# Altium schematic sheet MTCH9010_Evaluation_Kit.SchDoc
size A3; SheetTitle: MTCH9010 Evaluation Kit; CompanyName: Microchip Technology Inc.; Organization: Microchip Technology; Address1: 2355 West Chandler Blvd.; Address2: Chandler, AZ  85224; Address4: USA; SheetNumber: 2; SheetTotal: 4; Time: Time
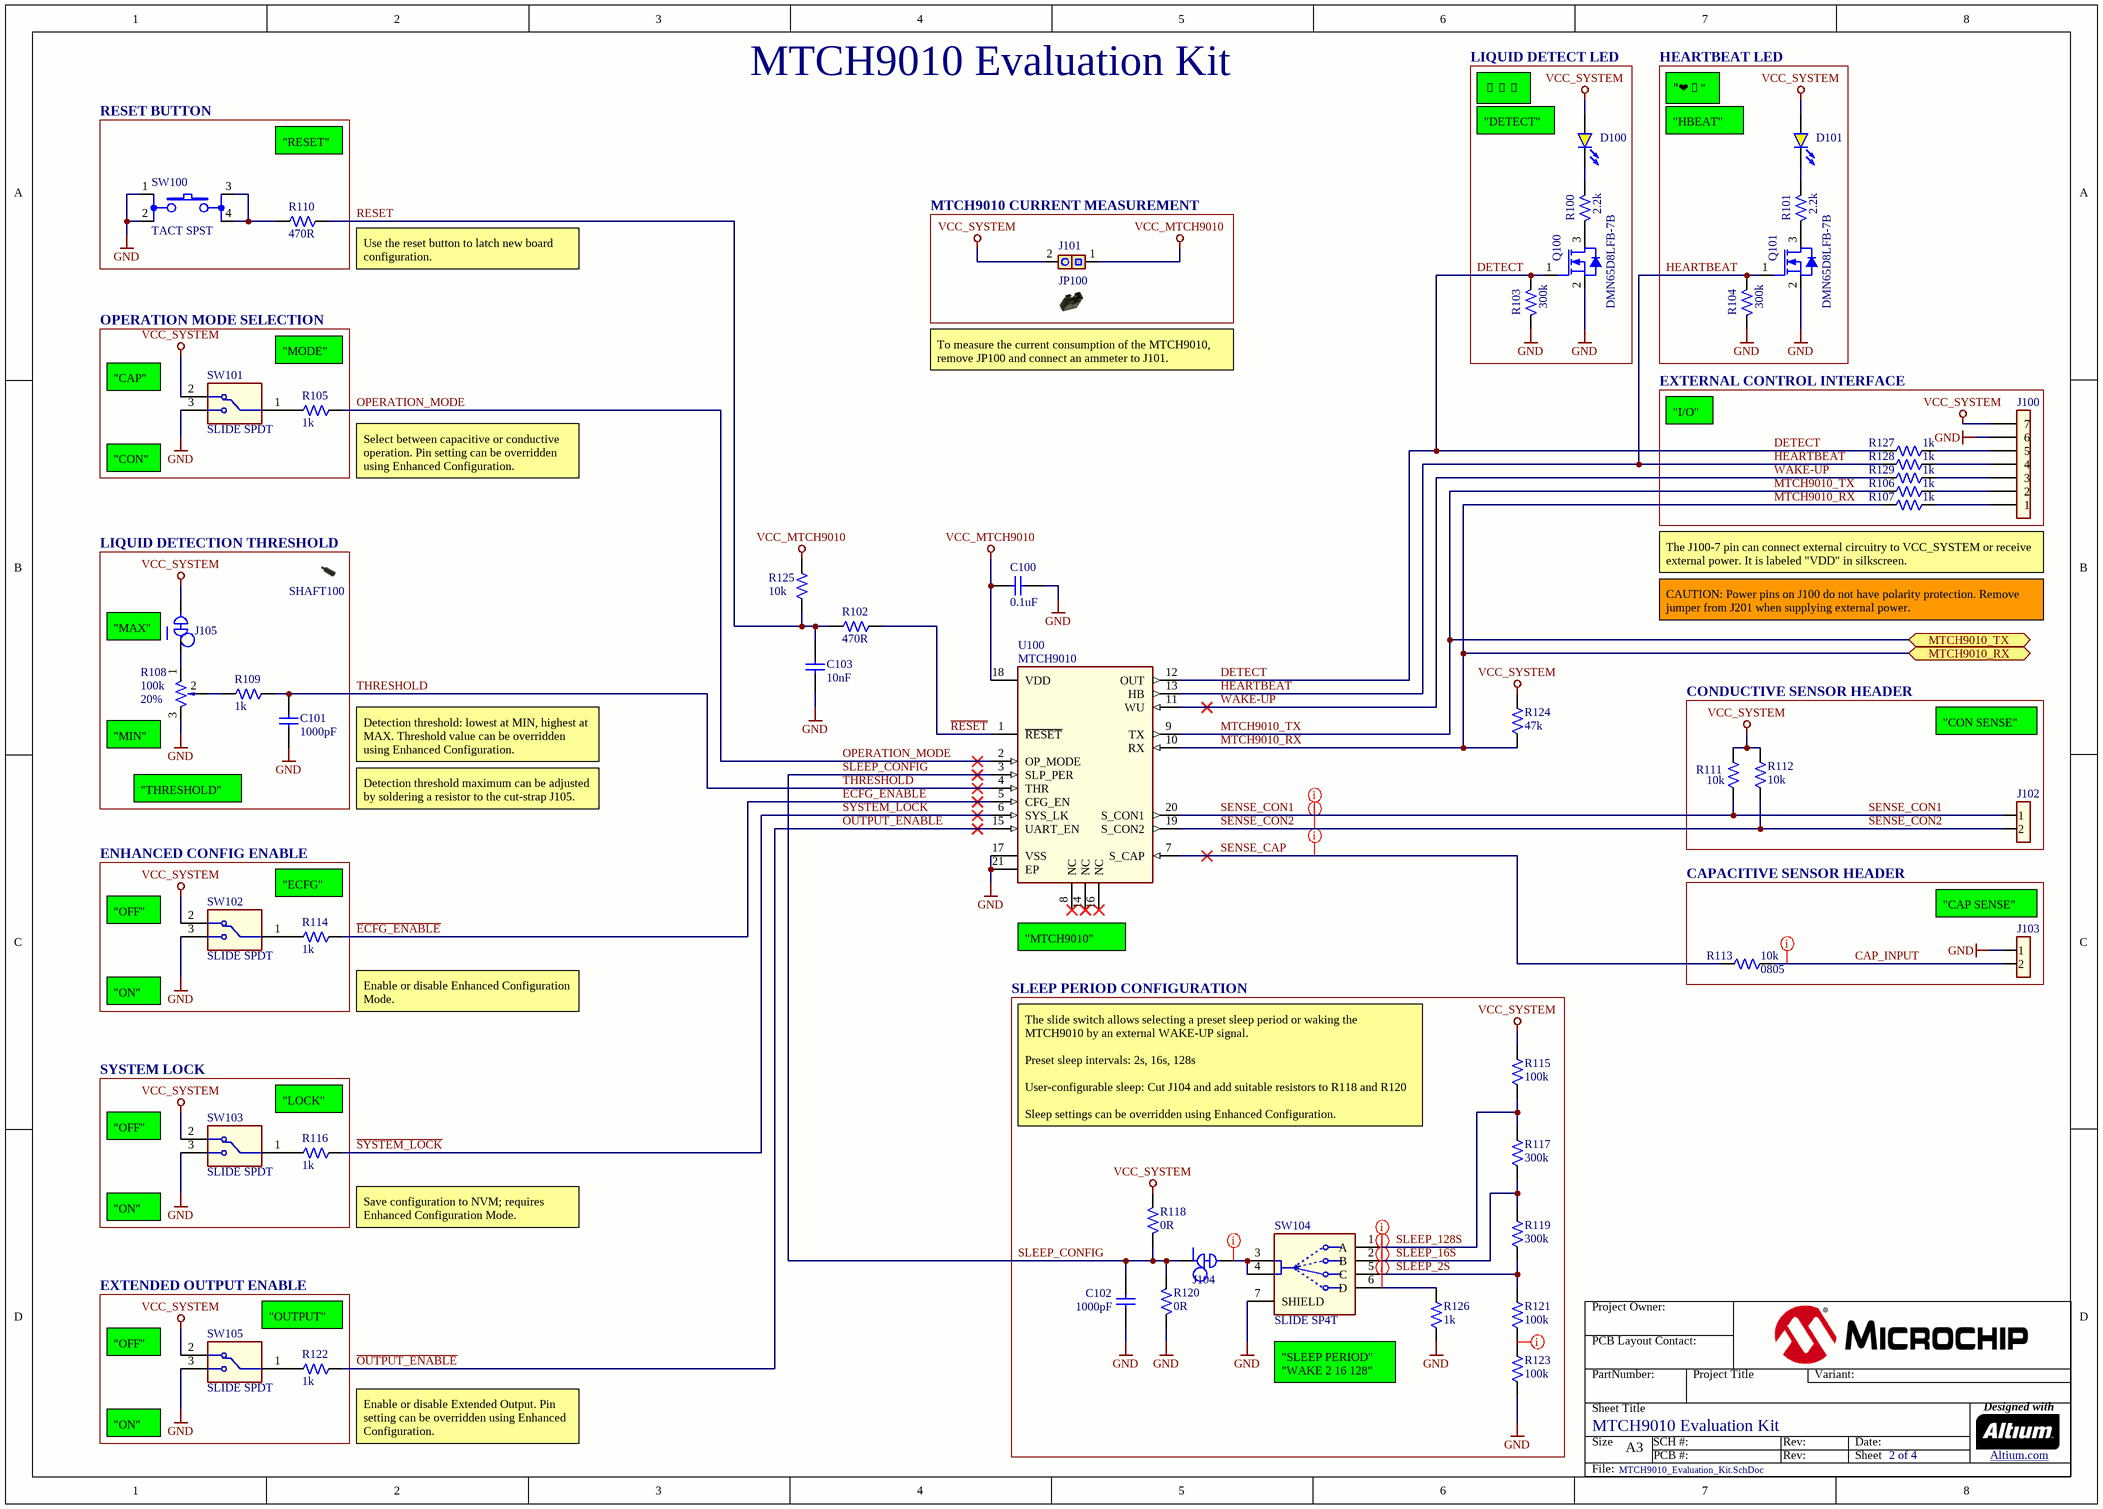
[diagram p0: MTCH9010_Evaluation_Kit.SchDoc]

## Parts
C100  value 0.1uF  [CAP_C_0402]  (hidden comment: Capacitor NP)
C101  value 1000pF  [CAP_C_0402]  (hidden comment: Capacitor NP)
C102  value 1000pF  [CAP_C_0402]  (hidden comment: Capacitor NP)
C103  value 10nF  [CAP_C_0402]  (hidden comment: Capacitor NP)
D100  LED_yellow  [LED_DIA_597-6xxx_1206_RM]  (value not drawn)
D101  LED_yellow  [LED_DIA_597-6xxx_1206_RM]  (value not drawn)
J100  Header 1x7  [HDR_F_2.54_1x7_TH-PIP_RA_WCON_2185-107RSNCYNR1]  (value not drawn)
J101  Header 1x2  [HDR_M_2.54_1X2_U_TH-PIP_RA_WCON_1125-1102S0R140CR01]  (value not drawn)
J102  Header 1x2  [HDR_F_2.54_1x2_TH-PIP_RA_WCON_2185-102RSNCYNR1]  (value not drawn)
J103  Header 1x2  [HDR_F_2.54_1x2_TH-PIP_RA_WCON_2185-102RSNCYNR1]  (value not drawn)
J104  CON JMPR LINK CLOSED  [CON_JMPR_0402_PCB_TRACE_LINK]  (value not drawn)  (net tie, no BOM)
J105  CON JMPR LINK CLOSED  [CON_JMPR_0603_PCB_TRACE_LINK_N]  (value not drawn)  (net tie, no BOM)
JP100  Jumper Mechanical  [Jumper_Mechanical]  (value not drawn)
Q100  value DMN65D8LFB-7B  [X1-DFN1006-3]  (hidden comment: Transistor MOS-N GSD)
Q101  value DMN65D8LFB-7B  [X1-DFN1006-3]  (hidden comment: Transistor MOS-N GSD)
R100  value 2.2k  [RES_C_0402]  (hidden comment: Resistor)
R101  value 2.2k  [RES_C_0402]  (hidden comment: Resistor)
R102  value 470R  [RES_C_0402]  (hidden comment: Resistor)
R103  value 300k  [RES_C_0402]  (hidden comment: Resistor)
R104  value 300k  [RES_C_0402]  (hidden comment: Resistor)
R105  value 1k  [RES_C_0402]  (hidden comment: Resistor)
R106  value 1k  [RES_C_0402]  (hidden comment: Resistor)
R107  value 1k  [RES_C_0402]  (hidden comment: Resistor)
R108  value 100k  Tolerance: 20%  [RES_VAR_PIHER_PS-10V60_L10.9W10.3H5.7]  (hidden comment: Resistor Var)
R109  value 1k  [RES_C_0402]  (hidden comment: Resistor)
R110  value 470R  [RES_C_0402]  (hidden comment: Resistor)
R111  value 10k  [RES_C_0805]  (hidden comment: Resistor)
R112  value 10k  [RES_C_0805]  (hidden comment: Resistor)
R113  value 10k  Package: 0805  [RES_C_0805]  (hidden comment: Resistor)
R114  value 1k  [RES_C_0402]  (hidden comment: Resistor)
R115  value 100k  [RES_C_0402]  (hidden comment: Resistor)
R116  value 1k  [RES_C_0402]  (hidden comment: Resistor)
R117  value 300k  [RES_C_0402]  (hidden comment: Resistor)
R118  value 0R  [RES_C_0603]  (hidden comment: Resistor)
R119  value 300k  [RES_C_0402]  (hidden comment: Resistor)
R120  value 0R  [RES_C_0603]  (hidden comment: Resistor)
R121  value 100k  [RES_C_0402]  (hidden comment: Resistor)
R122  value 1k  [RES_C_0402]  (hidden comment: Resistor)
R123  value 100k  [RES_C_0402]  (hidden comment: Resistor)
R124  value 47k  [RES_C_0402]  (hidden comment: Resistor)
R125  value 10k  [RES_C_0402]  (hidden comment: Resistor)
R126  value 1k  [RES_C_0402]  (hidden comment: Resistor)
R127  value 1k  [RES_C_0402]  (hidden comment: Resistor)
R128  value 1k  [RES_C_0402]  (hidden comment: Resistor)
R129  value 1k  [RES_C_0402]  (hidden comment: Resistor)
SHAFT100  PT10_SHAFT  [PT10_Shaft_Mechanical]  (value not drawn)
SW100  value TACT SPST  [SW_TACT_SMD_DW_TS604VM1-035CR-R]  (hidden comment: Switch 4 Pin)
SW101  value SLIDE SPDT  [SW_SLIDE_SMD_SS_SLW-88229-2-SMT-TR]  (hidden comment: SWITCH SLIDE SMD SPDT SLW-88229-2-SMT-TR)
SW102  value SLIDE SPDT  [SW_SLIDE_SMD_SS_SLW-88229-2-SMT-TR]  (hidden comment: SWITCH SLIDE SMD SPDT SLW-88229-2-SMT-TR)
SW103  value SLIDE SPDT  [SW_SLIDE_SMD_SS_SLW-88229-2-SMT-TR]  (hidden comment: SWITCH SLIDE SMD SPDT SLW-88229-2-SMT-TR)
SW104  value SLIDE SP4T  [SW_SLIDE_SMD_RA_SP4T_L-KLS7-MSS-1400SD-BR]  (hidden comment: SWITCH SLIDE SMD SP4T)
SW105  value SLIDE SPDT  [SW_SLIDE_SMD_SS_SLW-88229-2-SMT-TR]  (hidden comment: SWITCH SLIDE SMD SPDT SLW-88229-2-SMT-TR)
U100  value MTCH9010  [VQFN-20_3X3_EP1.8x1.8_NO_VIAS]  (hidden comment: MTCH9010-VQFN20)

## Blocks framed on the sheet
LIQUID DETECT LED: D100 Q100 R100 R103
HEARTBEAT LED: D101 Q101 R101 R104
RESET BUTTON: R110 SW100
MTCH9010 CURRENT MEASUREMENT: J101 JP100
OPERATION MODE SELECTION: R105 SW101
EXTERNAL CONTROL INTERFACE: J100 R106 R107 R127-R129
LIQUID DETECTION THRESHOLD: C101 J105 R108 R109 SHAFT100
CONDUCTIVE SENSOR HEADER: J102 R111 R112
ENHANCED CONFIG ENABLE: R114 SW102
CAPACITIVE SENSOR HEADER: J103 R113
SLEEP PERIOD CONFIGURATION: C102 J104 R115 R117-R121 R123 R126 SW104
SYSTEM LOCK: R116 SW103
EXTENDED OUTPUT ENABLE: R122 SW105

## Ports
MTCH9010_RX (bidir), MTCH9010_TX (bidir)

## Nets
GND: C100.2 C101.1 C102.1 C103.2 J100.6 J103.1 Q100.2(S) Q101.2(S) R103.1 R104.1 R108.3(CW) R120.1 R123.1 R126.2 SW100.1 SW100.2 SW101.3 SW102.3 SW103.3 SW104.7(SHIELD) SW105.3 U100.17(VSS) U100.21(EP)
VCC_MTCH9010: C100.1 J101.1 R125.2 U100.18(VDD)
VCC_SYSTEM: D100.1(A) D101.1(A) J100.7 J101.2 J105.2 R111.2 R112.2 R115.2 R118.2 R124.2 SW101.2 SW102.2 SW103.2 SW105.2
~{ECFG_ENABLE}: R114.1 U100.5(CFG_EN)
~{OUTPUT_ENABLE}: R122.1 U100.15(UART_EN)
~{RESET}: R102.1 U100.1(~{RESET})
~{SYSTEM_LOCK}: R116.1 U100.6(SYS_LK)
CAP_INPUT: J103.2 R113.2
DETECT: Q100.1(G) R103.2 R127.2 U100.12(OUT)
HEARTBEAT: Q101.1(G) R104.2 R128.2 U100.13(HB)
MTCH9010_RX: R107.2 R124.1 U100.10(RX) ; port MTCH9010_RX
MTCH9010_TX: R106.2 U100.9(TX) ; port MTCH9010_TX
OPERATION_MODE: R105.1 U100.2(OP_MODE)
RESET: C103.1 R102.2 R110.1 R125.1
SENSE_CAP: R113.1 U100.7(S_CAP)
SENSE_CON1: J102.1 R111.1 U100.20(S_CON1)
SENSE_CON2: J102.2 R112.1 U100.19(S_CON2)
SLEEP_2S: R119.2 R121.2 SW104.5(C)
SLEEP_16S: R117.2 R119.1 SW104.2(B)
SLEEP_128S: R115.1 R117.1 SW104.1(A)
SLEEP_CONFIG: C102.2 J104.1 R118.1 R120.2 U100.3(SLP_PER)
THRESHOLD: C101.2 R109.1 U100.4(THR)
WAKE-UP: R129.2 U100.11(WU)
NetD100_2: D100.2(K) R100.2
NetD101_2: D101.2(K) R101.2
NetJ100_1: J100.1 R107.1
NetJ100_2: J100.2 R106.1
NetJ100_3: J100.3 R129.1
NetJ100_4: J100.4 R128.1
NetJ100_5: J100.5 R127.1
NetJ104_2: J104.2 SW104.3 SW104.4
NetJ105_1: J105.1 R108.1(CCW)
NetQ100_3: Q100.3(D) R100.1
NetQ101_3: Q101.3(D) R101.1
NetR105_2: R105.2 SW101.1
NetR108_2: R108.2(Wiper) R109.2
NetR110_2: R110.2 SW100.3 SW100.4
NetR114_2: R114.2 SW102.1
NetR116_2: R116.2 SW103.1
NetR121_1: R121.1 R123.2
NetR122_2: R122.2 SW105.1
NetR126_1: R126.1 SW104.6(D)

Not connected (* = marked no-connect by the designer): U100 8(NC)* 14(NC)* 16(NC)*

## Layout directives
net class SENSE; net class NO TESTPOINT: CAP_INPUT, SENSE_CAP, SENSE_CON1, SENSE_CON2
net class NO TESTPOINT: NetJ104_2, NetR121_1, NetR126_1, SLEEP_2S, SLEEP_16S, SLEEP_128S

## Notes on the sheet
- MTCH9010 Evaluation Kit
- "💧"
- "❤️"
- "RESET"
- (near D100) "DETECT"
- "HBEAT"
- (near R110) Use the reset button to latch new board configuration.
- "MODE"
- (near JP100) To measure the current consumption of the MTCH9010, remove JP100 and connect an ammeter to J101.
- (near SW101) "CAP"
- "I/O"
- "CON"
- (near R105) Select between capacitive or conductive operation. Pin setting can be overridden using Enhanced Configuration.
- The J100-7 pin can connect external circuitry to VCC_SYSTEM or receive external power. It is labeled "VDD" in silkscreen.
- (near J105) "MAX"
- CAUTION: Power pins on J100 do not have polarity protection. Remove jumper from J201 when supplying external power.
- (near R108) "MIN"
- Detection threshold: lowest at MIN, highest at MAX. Threshold value can be overridden using Enhanced Configuration.
- "CON SENSE"
- "THRESHOLD"
- Detection threshold maximum can be adjusted by soldering a resistor to the cut-strap J105.
- (near SW102) "OFF"
- "ECFG"
- (near J103) "CAP SENSE"
- (near U100) "MTCH9010"
- "ON"
- (near R114) Enable or disable Enhanced Configuration Mode.
- "LOCK"
- The slide switch allows selecting a preset sleep period or waking the MTCH9010 by an external WAKE-UP signal.
  Preset sleep intervals: 2s, 16s, 128s
  User-configurable sleep: Cut J104 and add suitable resistors to R118 and R120
  Sleep settings can be overridden using Enhanced Configuration.
- (near SW103) "OFF"
- (near R116) Save configuration to NVM; requires Enhanced Configuration Mode.
- "OUTPUT"
- (near SW105) "OFF"
- "SLEEP PERIOD"
  "WAKE 2 16 128"
- (near R122) Enable or disable Extended Output. Pin setting can be overridden using Enhanced Configuration.
- Project Owner:
- PCB Layout Contact:
- PartNumber:
- Project Title
- Variant:
- Sheet Title
- Size
- A3
- SCH #:
- PCB #:
- Rev:
- Date:
- Sheet
- Designed with
- Altium.com <http://go.altium.com/MicrochipLandingPage_Evaluation.html>
- File:

## Library data of the parts
C100 = CAP1033: Manufacturer 1: KEMET; Manufacturer Part Number 1: C0402C104K4RAC7867; Voltage: 16V; Description_: CAP CER 0.1uF 16V 10% X7R SMD 0402; Tolerance: 10%; Type: Ceramic; Populated: Yes; Temperature Coefficient: X7R; MCHP-ID: CAP1033; Package: 0402; Revision: 11; Symbol: Capacitor NP; Operating Temperature: -55C to +125C; Category: Capacitor; Manufacturer 2: Samsung Electro-Mechanics; Manufacturer Part Number 2: CL05B104KO5NNNC; Supplier 1: Digi-Key; Supplier Part Number 1: 399-C0402C104K4RAC7867TR-ND; Supplier 2: Digi-Key; Supplier Part Number 2: 1276-1001-1-ND; Manufacturer 3: Würth Elektronik; Manufacturer Part Number 3: 885012205037; Manufacturer 4: Samsung Electro-Mechanics; Manufacturer Part Number 4: CL05B104KO5NNND; Manufacturer 5: Samsung Electro-Mechanics; Manufacturer Part Number 5: CL05B104KO5NNNO; Manufacturer 6: Yageo; Manufacturer Part Number 6: CC0402KRX7R7BB104; Supplier 3: Digi-Key; Supplier Part Number 3: 732-7532-1-ND; Supplier 4: Mouser; Supplier Part Number 4: 187-CL05B104KO5NNND; Supplier 5: Samsung Electro-Mechanics; Supplier Part Number 5: CL05B104KO5NNNO; Supplier 6: Yageo; Supplier Part Number 6: CC0402KRX7R7BB104
C101 C102 = CAP2439: Manufacturer 1: Samsung Electro-Mechanics; Manufacturer Part Number 1: CL05B102KA5NNWC; Voltage: 25V; Description_: Ceramic capacitor, SMD 0402, X7R, 25V, +/-10%, 1000pF; Tolerance: 10%; Temperature Coefficient: X7R; Type: Ceramic; Populated: YES; MCHP-ID: CAP2439; Package: 0402; Revision: 2; Symbol: Capacitor NP; Operating Temperature: -55C to +125C; Category: Capacitor; Supplier 1: Digi-Key; Supplier Part Number 1: 1276-1490-1-ND
C103 = CAP2597: Manufacturer 1: Samsung Electro-Mechanics; Manufacturer Part Number 1: CL05B103KB5NNNC; Voltage: 50V; Description_: CAP CER 10nF 10% 50V X7R 0402; Tolerance: 10%; Temperature Coefficient: X7R; Type: Ceramic; Populated: YES; MCHP-ID: CAP2597; Package: 0402; Revision: 1; Symbol: Capacitor NP; Operating Temperature: -55°C - 125°C; Category: Capacitor; Manufacturer 2: Murata; Manufacturer Part Number 2: GRM155R71H103KA88D; Supplier 1: Digi-Key; Supplier Part Number 1: 1276-1028-1-ND; Supplier 2: Digi-Key; Supplier Part Number 2: 490-4516-2-ND
D100 D101 = DIODE1857: LED; Manufacturer 1: Kingbright; Manufacturer Part Number 1: APTL3216SYCK-01; Value: YELLOW; Description_: DIO LED YELLOW 2V 20mA 350mcd Clear SMD RM 1206; Type: LED Single; Forward Current: 20mA; Power: 75mW; Populated: YES; MCHP-ID: DIODE1857; Revision: 1; Symbol: LED_yellow; Package: 1206; Operating Temperature: -55°C to +85°C; Category: Diode; Supplier 1: Digi-Key; Supplier Part Number 1: 754-APTL3216SYCK01CT-ND
J100 = CON3021: Manufacturer 1: WCON; Manufacturer Part Number 1: 2185-107RSNCYNR1; Value: HDR-2.54 Female 1x7; Description_: CON HDR-2.54 FEMALE 1x7 TIN 5.00MH TH-PIP R/A; Populated: YES; Voltage: 1kV; Current: 3A; MCHP-ID: CON3021; Assembly Type: TH PIP; Revision: 1; Symbol: Header 1x7; Type: Header 2.54mm; Category: Connector; Supplier 1: Cabcon A/S; Supplier Part Number 1: 2185-107RSNCYNR1; Operating Temperature: -40°C to +105°C
J101 = CON3018: Manufacturer 1: WCON; Manufacturer Part Number 1: 1125-1102S0R140CR01; Value: HDR-2.54 Male 1x2; Description_: CON HDR-2.54 MALE 1x2 GOLD FLASH/TIN 6.00MH TH-PIP R/A; Voltage: 1kV; Current: 3A; Populated: YES; MCHP-ID: CON3018; Assembly Type: TH PIP; Revision: 1; Symbol: Header 1x2; Type: Header 2.54mm; Category: Connector; Supplier 1: Cabcon A/S; Supplier Part Number 1: 1125-1102S0R140CR01; Operating Temperature: -40°C to +105°C
J102 J103 = CON3020: Manufacturer 1: WCON; Manufacturer Part Number 1: 2185-102RSNCYNR1; Value: HDR-2.54 Female 1x2; Description_: CON HDR-2.54 FEMALE 1x2 TIN 5.00MH TH-PIP R/A; Populated: YES; Voltage: 1kV; Current: 3A; MCHP-ID: CON3020; Assembly Type: TH PIP; Revision: 1; Symbol: Header 1x2; Type: Header 2.54mm; Category: Connector; Supplier 1: Cabcon A/S; Supplier Part Number 1: 2185-102RSNCYNR1; Operating Temperature: -40°C to +105°C
J104 = CON2116: Value: CON 0402 PCB TRACE LINK; Description_: CON JUMPER 0402 CLOSED PCB TRACE LINK MANUAL CUT; Populated: DNP; Revision: 1; Symbol: CON JMPR LINK CLOSED; Category: Connector; Assembly Type: Mechanical; MCHP-ID: CON2116
J105 = CON2772: Value: CON 0603 PCB TRACE LINK; Description_: CON JUMPER 0603 CLOSED PCB TRACE LINK MANUAL CUT; Populated: DNP; MCHP-ID: CON2772; Revision: 1; Symbol: CON JMPR LINK CLOSED; Category: Connector; Assembly Type: Mechanical
JP100 = MECH0482: Manufacturer 1: WCON; Manufacturer Part Number 1: 3710-6001OS0B01; Value: JUMPER 2.54mm 1x2; Description_: MECH HW JUMPER 2.54mm 1x2 Black; Populated: MECH; MCHP-ID: MECH0482; Revision: 2; Symbol: Jumper Mechanical; Type: Jumper; Category: Hardware; Supplier 1: Cabcon A/S; Supplier Part Number 1: 3710-6001OS0B01; Operating Temperature: -40C to +105C
Q100 Q101 = TRA1340: Transistor MOS; Manufacturer 1: Diodes Incorporated; Manufacturer Part Number 1: DMN65D8LFB-7; Description_: TRANS FET N-CH DMN65D8LFB-7B 260mA 60V 430mW X1_DFN1006-3; Type: FET; Current: 260mA; Drain to Source Voltage: 60V; Power: 430mW; Populated: YES; MCHP-ID: TRA1340; Revision: 3; Symbol: Transistor MOS-N GSD; Package: X1-DFN1006-3; Category: Transistor; Voltage: 60V; Supplier 1: Digi-Key; Supplier Part Number 1: DMN65D8LFB-7DITR-ND; Manufacturer 2: Diodes Incorporated; Manufacturer Part Number 2: DMN65D8LFB-7B; Supplier 2: Digi-Key; Supplier Part Number 2: DMN65D8LFB-7BDICT-ND
R100 R101 = RES1023: Manufacturer 1: Panasonic; Manufacturer Part Number 1: ERJ-2RKF2201X; Tolerance: 1%; Description_: RES TKF 2.2k 1% 1/10W SMD 0402; Power: 1/10W; Populated: YES; Temperature Coefficient: 100ppm/C; Voltage: 50V; MCHP-ID: RES1023; Package: 0402; Revision: 1; Symbol: Resistor; Operating Temperature: -55C to +155C; Category: Resistor; Type: RES SMD; Supplier 1: Digi-Key; Supplier Part Number 1: P2.20KLTR-ND; Composition: TKF
R102 R110 = RSMT1163: Manufacturer 1: Yageo; Manufacturer Part Number 1: RC0402FR-07470RL; Tolerance: 1%; Description_: RES TKF 470R 1% 1/16W MF 0402; Populated: YES; MCHP-ID: RSMT1163; Package: 0402; Revision: 2; Symbol: resistor; Category: Resistor; Type: RES SMD; Supplier 1: Digi-Key; Supplier Part Number 1: 311-470LRCT-ND
R103 R104 = RES1010: Manufacturer 1: Panasonic; Manufacturer Part Number 1: ERJ-2RKF3003X; Tolerance: 1%; Description_: RES TKF 300k 1% 1/10W SMD 0402; Voltage: 50V; Populated: YES; Power: 1/10W; Temperature Coefficient: 100ppm/C; MCHP-ID: RES1010; Package: 0402; Revision: 1; Symbol: Resistor; Category: Resistor; Type: RES SMD; Composition: TKF; Supplier 1: Digi-Key; Supplier Part Number 1: P300KLTR-ND; Operating Temperature: -55C to +125C
R105-R107 R109 R114 R116 R122 R126-R129 = RES1022: Manufacturer 1: Panasonic; Manufacturer Part Number 1: ERJ-2RKF1001X; Tolerance: 1%; Description_: RES TKF 1k 1% 1/10W SMD 0402; Voltage: 50V; Power: 1/10W; Populated: YES; Temperature Coefficient: 100ppm/C; MCHP-ID: RES1022; Package: 0402; Revision: 3; Symbol: Resistor; Operating Temperature: -55C to +155C; Category: Resistor; Type: RES SMD; Composition: TKF; Supplier 1: Digi-Key; Supplier Part Number 1: P1.00KLTR-ND
R108 = RPOT1027: Manufacturer 1: KLS Electronic; Manufacturer Part Number 1: L-KLS4-PT10-M-V60-104-A-2020-T; Description_: RES TRIMMER Carbon 100k 20% 0.15W SMD V60; Voltage: 100V; Power: 0.15W; Populated: YES; MCHP-ID: RPOT1027; Package: V60; Revision: 2; Symbol: Resistor Var; Category: Resistor; Type: Trimmer; Supplier 1: Cabcon A/S; Supplier Part Number 1: L-KLS4-PT10-M-V60-104-A-2020-T; Composition: CC; Manufacturer 2: KLS Electronic; Manufacturer Part Number 2: L-KLS4-PT10-M-V60-104-A-2020; Supplier 2: Cabcon A/S; Supplier Part Number 2: L-KLS4-PT10-M-V60-104-A-2020
R111 R112 = RSMT0156: Manufacturer 1: Panasonic; Manufacturer Part Number 1: ERJ-6ENF1002V; Tolerance: 1%; Description_: RES TKF 10k 1% 1/8W SMD 0805; Voltage: 150V; Temperature Coefficient: 100ppm/C; Power: 1/8W; Populated: Yes; MCHP-ID: RSMT0156; Package: 0805; Revision: 3; Symbol: Resistor; Operating Temperature: -55C to +155C; Category: Resistor; Type: RES SMD; Composition: TKF; Manufacturer 2: Stackpole Electronics Inc; Manufacturer Part Number 2: RMCF0805FT10K0; Manufacturer 3: Vishay; Manufacturer Part Number 3: CRCW080510K0FKEA; Supplier 1: Digi-Key; Supplier Part Number 1: P10.0KCTR-ND; Supplier 2: Digi-Key; Supplier Part Number 2: RMCF0805FT10K0TR-ND; Supplier 3: Digi-Key; Supplier Part Number 3: 541-10.0KCTR-ND
R113 = RSMT0156: Manufacturer 1: Panasonic; Manufacturer Part Number 1: ERJ-6ENF1002V; Tolerance: 1%; Description_: RES TKF 10k 1% 1/8W SMD 0805; Temperature Coefficient: 100ppm/C; Power: 1/8W; Populated: Yes; Voltage: 150V; MCHP-ID: RSMT0156; Revision: 3; Symbol: Resistor; Operating Temperature: -55C to +155C; Category: Resistor; Type: RES SMD; Composition: TKF; Supplier 1: Digi-Key; Supplier Part Number 1: P10.0KCTR-ND; Manufacturer 2: Stackpole Electronics Inc; Manufacturer 3: Vishay; Manufacturer Part Number 2: RMCF0805FT10K0; Manufacturer Part Number 3: CRCW080510K0FKEA; Supplier 2: Digi-Key; Supplier 3: Digi-Key; Supplier Part Number 2: RMCF0805FT10K0TR-ND; Supplier Part Number 3: 541-10.0KCTR-ND
R115 R121 R123 = RES1457: Manufacturer 1: KOA Speer; Manufacturer Part Number 1: RK73H1ETTP1003F; Tolerance: 1%; Description_: RES TKF 100k 1% 1/16W SMD 0402; Temperature Coefficient: 100ppm/C; Circuit Type: Isolated; Power: 1/16W; Populated: YES; MCHP-ID: RES1457; Package: 0402; Revision: 1; Symbol: Resistor; Operating Temperature: -55C to +155C; Category: Resistor; Type: RES SMD; Composition: TF; Supplier 1: Mouser; Supplier Part Number 1: 660-RK73H1ETTP1003F
R117 R119 = RES1010: Manufacturer 1: Panasonic; Manufacturer Part Number 1: ERJ-2RKF3003X; Tolerance: 1%; Description_: RES TKF 300k 1% 1/10W SMD 0402; Voltage: 50V; Temperature Coefficient: 100ppm/C; Power: 1/10W; Populated: YES; MCHP-ID: RES1010; Package: 0402; Revision: 1; Symbol: Resistor; Operating Temperature: -55C to +125C; Category: Resistor; Type: RES SMD; Composition: TKF; Supplier 1: Digi-Key; Supplier Part Number 1: P300KLTR-ND
R118 R120 = RSMT0001: Manufacturer 1: Panasonic; Manufacturer Part Number 1: ERJ-3GEY0R00V; Description_: RES TKF 0R 1/10W SMD 0603; Power: 1/10W; Populated: Yes; MCHP-ID: RSMT0001; Package: 0603; Revision: 7; Symbol: Resistor; Operating Temperature: -55C to +155C; Category: Resistor; Type: RES SMD; Composition: TKF; Manufacturer 2: Stackpole Electronics Inc; Manufacturer Part Number 2: RMCF0603ZT0R00; Supplier 1: Digi-Key; Supplier Part Number 1: P0.0GTR-ND; Supplier 2: Digi-Key; Supplier Part Number 2: RMCF0603ZT0R00TR-ND; Manufacturer 3: Vishay; Manufacturer 4: Yageo; Manufacturer 5: KOA Speer; Manufacturer Part Number 3: CRCW06030000Z0EA; Manufacturer Part Number 4: RC0603JR-070RL; Manufacturer Part Number 5: RK73Z1JTTP; Supplier 3: Digi-Key; Supplier 4: Digi-Key; Supplier 5: Digi-Key; Supplier 6: Mouser; Supplier Part Number 3: RMCF0603ZT0R00CT-ND; Supplier Part Number 4: 541-0.0GCT-ND; Supplier Part Number 5: 311-0.0GRCT-ND; Supplier Part Number 6: 660-RK73Z1JTTP
R124 = RES2662: Manufacturer 1: Yageo; Manufacturer Part Number 1: RC0402FR-0747KL; Tolerance: 1%; Description_: RES TKF 47k 1% 1/16W SMD 0402; Voltage: 50V; Populated: YES; MCHP-ID: RES2662; Package: 0402; Revision: 3; Symbol: Resistor; Category: Resistor; Type: RES SMD; Composition: TKF; Supplier 1: Digi-Key; Supplier Part Number 1: 311-47.0KLRCT-ND
R125 = RES2543: Manufacturer 1: TE Connectivity; Manufacturer Part Number 1: CRG0402F10K; Tolerance: 1%; Description_: RES TKF 10k 1% 1/16W SMD 0402; Voltage: 50V; Temperature Coefficient: 100ppm/C; Power: 1/16W; Populated: YES; MCHP-ID: RES2543; Package: 0402; Revision: 3; Symbol: Resistor; Operating Temperature: -55C to 155C; Category: Resistor; Type: RES SMD; Composition: TKF; Supplier 1: Digi-Key; Supplier Part Number 1: A121528CT-ND
SHAFT100 = MECH0618: Manufacturer 1: Piher; Manufacturer Part Number 1: JPEPL5012NEI; Value: MISC PT10-SHAFT; Description_: MECH HW MISC PT10-SHAFT; Populated: MECH; MCHP-ID: MECH0618; Revision: 1; Symbol: PT10_SHAFT; Type: Misc; Category: Hardware; Supplier 1: Digi-Key; Supplier Part Number 1: 1993-JPEPL5012NEI-ND; Operating Temperature: -40C to +90C
SW100 = SWITCH1172: Switch; Manufacturer 1: Dailywell Electronics Co.,Ltd.; Manufacturer Part Number 1: TS604VM1-035CR-R; Description_: SWITCH TACT SPST 12 50mA TS604VM1-035CR-R SMD; Voltage: 12V; Current: 50mA; Populated: YES; MCHP-ID: SWITCH1172; Revision: 2; Symbol: Switch 4 Pin; Category: Switch; Supplier 1: Cabcon A/S; Supplier Part Number 1: TS604VM1-035CR-R; Type: Tactile; Operating Temperature: -40C to +85C
SW101-SW103 SW105 = SWITCH1238: Manufacturer 1: Same Sky; Description_: SWITCH SLIDE SPDT 12V 100mA SLW-88229-2-SMT-TR SMD; Voltage: 12V; Current: 100mA; Populated: YES; MCHP-ID: SWITCH1238; Revision: 1; Symbol: SWITCH SLIDE SMD SPDT SLW-88229-2-SMT-TR; Category: Switch; Type: Slide; Manufacturer Part Number 1: SLW-88229-2-SMT-TR; Supplier 1: Digi-Key; Supplier Part Number 1: 2223-SLW-88229-2-SMT-TR-ND; Operating Temperature: -20C to +70C
SW104 = SWITCH1240: Manufacturer 1: KLS Electronic; Manufacturer Part Number 1: L-KLS7-MSS-1400SD-BR; Description_: SWITCH SLIDE SP4T 12V 50mA L-KLS7-MSS-1400SD-BR SMD; Voltage: 12V; Current: 50mA; Populated: YES; MCHP-ID: SWITCH1240; Revision: 1; Symbol: SWITCH SLIDE SMD SP4T; Operating Temperature: -25C to 70C; Category: Switch; Type: Slide; Supplier 1: Cabcon A/S; Supplier Part Number 1: L-KLS7-MSS-1400SD-BR
U100 = IC2705: Manufacturer 1: Microchip Technology; Manufacturer Part Number 1: MTCH9010T-I/REB; MCHP-ID: IC2705; Description_: MCHP INTERFACE TOUCH CONTROLLER UART/I2C MTCH9010-I/REB VQFN-20; Populated: YES; Symbol: MTCH9010-VQFN20; Type: Touch Controller; Revision: 1; Category: MCHP-Interface; Manufacturer 2: Microchip Technology; Manufacturer Part Number 2: MTCH9010-I/REB; Supplier 1: Microchip Technology; Supplier Part Number 1: MTCH9010T-I/REB; Supplier 2: Microchip Technology; Supplier Part Number 2: MTCH9010-I/REB; Operating Temperature: -40C to 85C